# Altium schematic sheet dv_analog_interface_ch.SchDoc
size 209 x 297 mm; DocumentNumber: 1; SheetNumber: 2; SheetTotal: 2; PageSetup: Record=PageOptions|CenterHorizontal=True|CenterVertical=True|PrintScale=1.00|XCorrection=1.00|YCorrection=1.00|PrintKind=1|BorderSize=5000000|LeftOffset=0|BottomOffset=0|Orientation=2|PaperLength=1000|PaperWidth=1000|Scale=100|PaperSource=15|PrintQuality=1200|MediaType=1|DitherType=10|PaperKind=A3|PrintScaleMode=1; Weight: -; ScaleFactor: -; NormInspection: Норм.Контр.
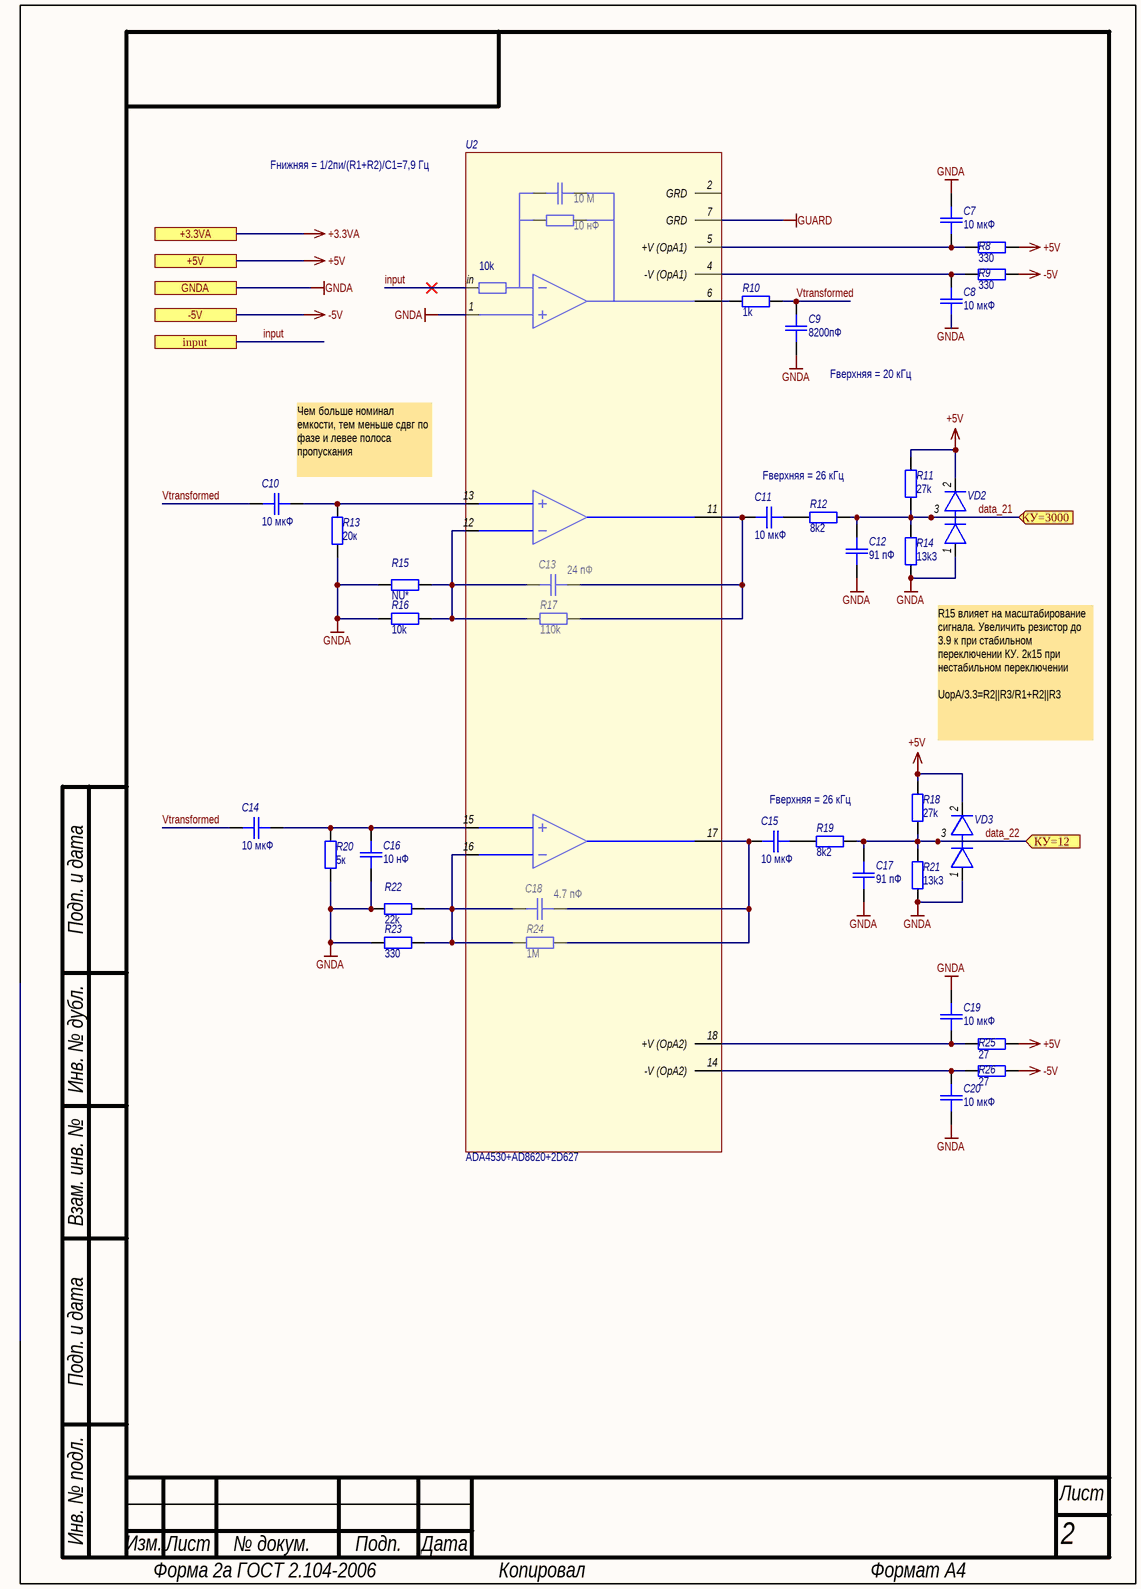
[diagram p0: dv_analog_interface_ch.SchDoc]

## Parts
C7  value 10 мкФ  [SMD_C0805]  (hidden comment: K10-79)
C8  value 10 мкФ  [SMD_C0805]  (hidden comment: K10-79)
C9  value 8200пФ  [SMD_C0805]  (hidden comment: K10-79)
C10  value 10 мкФ  [SMD_C0805]  (hidden comment: K10-79)
C11  value 10 мкФ  [SMD_C0805]  (hidden comment: K10-79)
C12  value 91 пФ  [SMD_C0805]  (hidden comment: K10-79)
C13  value 24 пФ  [SMD_C0805]  (hidden comment: K10-79)
C14  value 10 мкФ  [SMD_C0805]  (hidden comment: K10-79)
C15  value 10 мкФ  [SMD_C0805]  (hidden comment: K10-79)
C16  value 10 нФ  [SMD_C0805]  (hidden comment: K10-79)
C17  value 91 пФ  [SMD_C0805]  (hidden comment: K10-79)
C18  value 4.7 пФ  [SMD_C0805]  (hidden comment: K10-79)
C19  value 10 мкФ  [SMD_C0805]  (hidden comment: K10-79)
C20  value 10 мкФ  [SMD_C0805]  (hidden comment: K10-79)
R8  value 330  [SMD_0805]  (hidden comment: OSM R1-12)
R9  value 330  [SMD_0805]  (hidden comment: OSM R1-12)
R10  value 1k  [SMD_0805]  (hidden comment: OSM R1-12)
R11  value 27k  [SMD_0805]  (hidden comment: OSM R1-12)
R12  value 8k2  [SMD_0805]  (hidden comment: OSM R1-12)
R13  value 20к  [SMD_0805]  (hidden comment: OSM R1-12)
R14  value 13k3  [SMD_0805]  (hidden comment: OSM R1-12)
R15  value NU*  [SMD_0805]  (hidden comment: OSM R1-12)
R16  value 10k  [SMD_0805]  (hidden comment: OSM R1-12)
R17  value 110k  [SMD_0805]  (hidden comment: OSM R1-12)
R18  value 27k  [SMD_0805]  (hidden comment: OSM R1-12)
R19  value 8k2  [SMD_0805]  (hidden comment: OSM R1-12)
R20  value 5к  [SMD_0805]  (hidden comment: OSM R1-12)
R21  value 13k3  [SMD_0805]  (hidden comment: OSM R1-12)
R22  value 22k  [SMD_0805]  (hidden comment: OSM R1-12)
R23  value 330  [SMD_0805]  (hidden comment: OSM R1-12)
R24  value 1M  [SMD_0805]  (hidden comment: OSM R1-12)
R25  value 27  [SMD_0805]  (hidden comment: OSM R1-12)
R26  value 27  [SMD_0805]  (hidden comment: OSM R1-12)
U2  ADA4530+AD8620+2D627  [401.16-3+soic]
VD2  BAT54SW  [SOT-323 (SC-70)]  (value not drawn)
VD3  BAT54SW  [SOT-323 (SC-70)]  (value not drawn)

## Ports
+3.3VA, +5V, -5V, GNDA, input, КУ=12 (in), КУ=3000 (in)

## Nets
+3.3VA: port +3.3VA
+5V: R8.2 R11.2 R18.2 R25.2 VD2.2 VD3.2 ; port +5V
-5V: R9.1 R26.1 ; port -5V
GNDA: C7.1 C8.2 C9.1 C12.1 C16.1 C17.1 C19.1 C20.2 R13.1 R14.1 R15.2 R16.2 R20.1 R21.1 R22.2 R23.2 U2.1 VD2.1 VD3.1 ; port GNDA
GUARD: U2.7(GRD)
data_21: C12.2 R11.1 R12.2 R14.2 VD2.3 ; port КУ=3000
data_22: C17.2 R18.1 R19.2 R21.2 VD3.3 ; port КУ=12
input: U2.in ; port input
Vtransformed: C9.2 C10.2 C14.2 R10.2
NetC7_2: C7.2 R8.1 U2.5(+V_(OpA1))
NetC8_1: C8.1 R9.2 U2.4(-V_(OpA1))
NetC10_1: C10.1 R13.2 U2.13
NetC11_1: C11.1 R12.1
NetC11_2: C11.2 C13.1 R17.2 U2.11
NetC13_2: C13.2 R15.1 R16.1 R17.1 U2.12
NetC14_1: C14.1 C16.2 R20.2 U2.15
NetC15_1: C15.1 R19.1
NetC15_2: C15.2 C18.1 R24.2 U2.17
NetC18_2: C18.2 R22.1 R23.1 R24.1 U2.16
NetC19_2: C19.2 R25.1 U2.18(+V_(OpA2))
NetC20_1: C20.1 R26.2 U2.14(-V_(OpA2))
NetR10_1: R10.1 U2.6

Not connected (* = marked no-connect by the designer): U2 2 *(2) input(*)

## Notes on the sheet
- (near U2) Fнижняя = 1/2пи/(R1+R2)/C1=7,9 Гц
- Fверхняя = 20 кГц
- Чем больше номинал емкости, тем меньше сдвг по фазе и левее полоса пропускания
- Fверхняя = 26 кГц
- R15 влияет на масштабирование сигнала. Увеличить резистор до 3.9 к при стабильном переключении КУ. 2к15 при нестабильном переключении
  UopA/3.3=R2||R3/R1+R2||R3
- Подп. и дата
- Инв. № дубл.
- Взам. инв. №
- Инв. № подл.
- Изм.
- Лист
- № докум.
- Подп.
- Дата
- Форма 2а ГОСТ 2.104-2006
- Копировал
- Формат А4
- (in symbol ADA4530+AD8620+2D627) 10 М; 10 нФ; 10k

## Library data of the parts
C7-C20 = Capacitor: Назначение: SMD-конденсатор; Наименование: К10-79; Потребление, Вт: 0; Напряжение: В; Точность: %
R8-R26 = Resistor: Наименование: ОСМ Р1-12; Назначение: SMD-резистор; Потребление, Вт: 0,001; Точность: %
VD2 VD3 = BAT54SW: Schottky diodes; Назначение: Диодная сборка; ComponentLink1Description: DataSheet; Наименование: BAT54SW